# EAGLE schematic sEHnsor (EAGLE 6.5.0)
REVISION: A; TITLE: sEHnsor
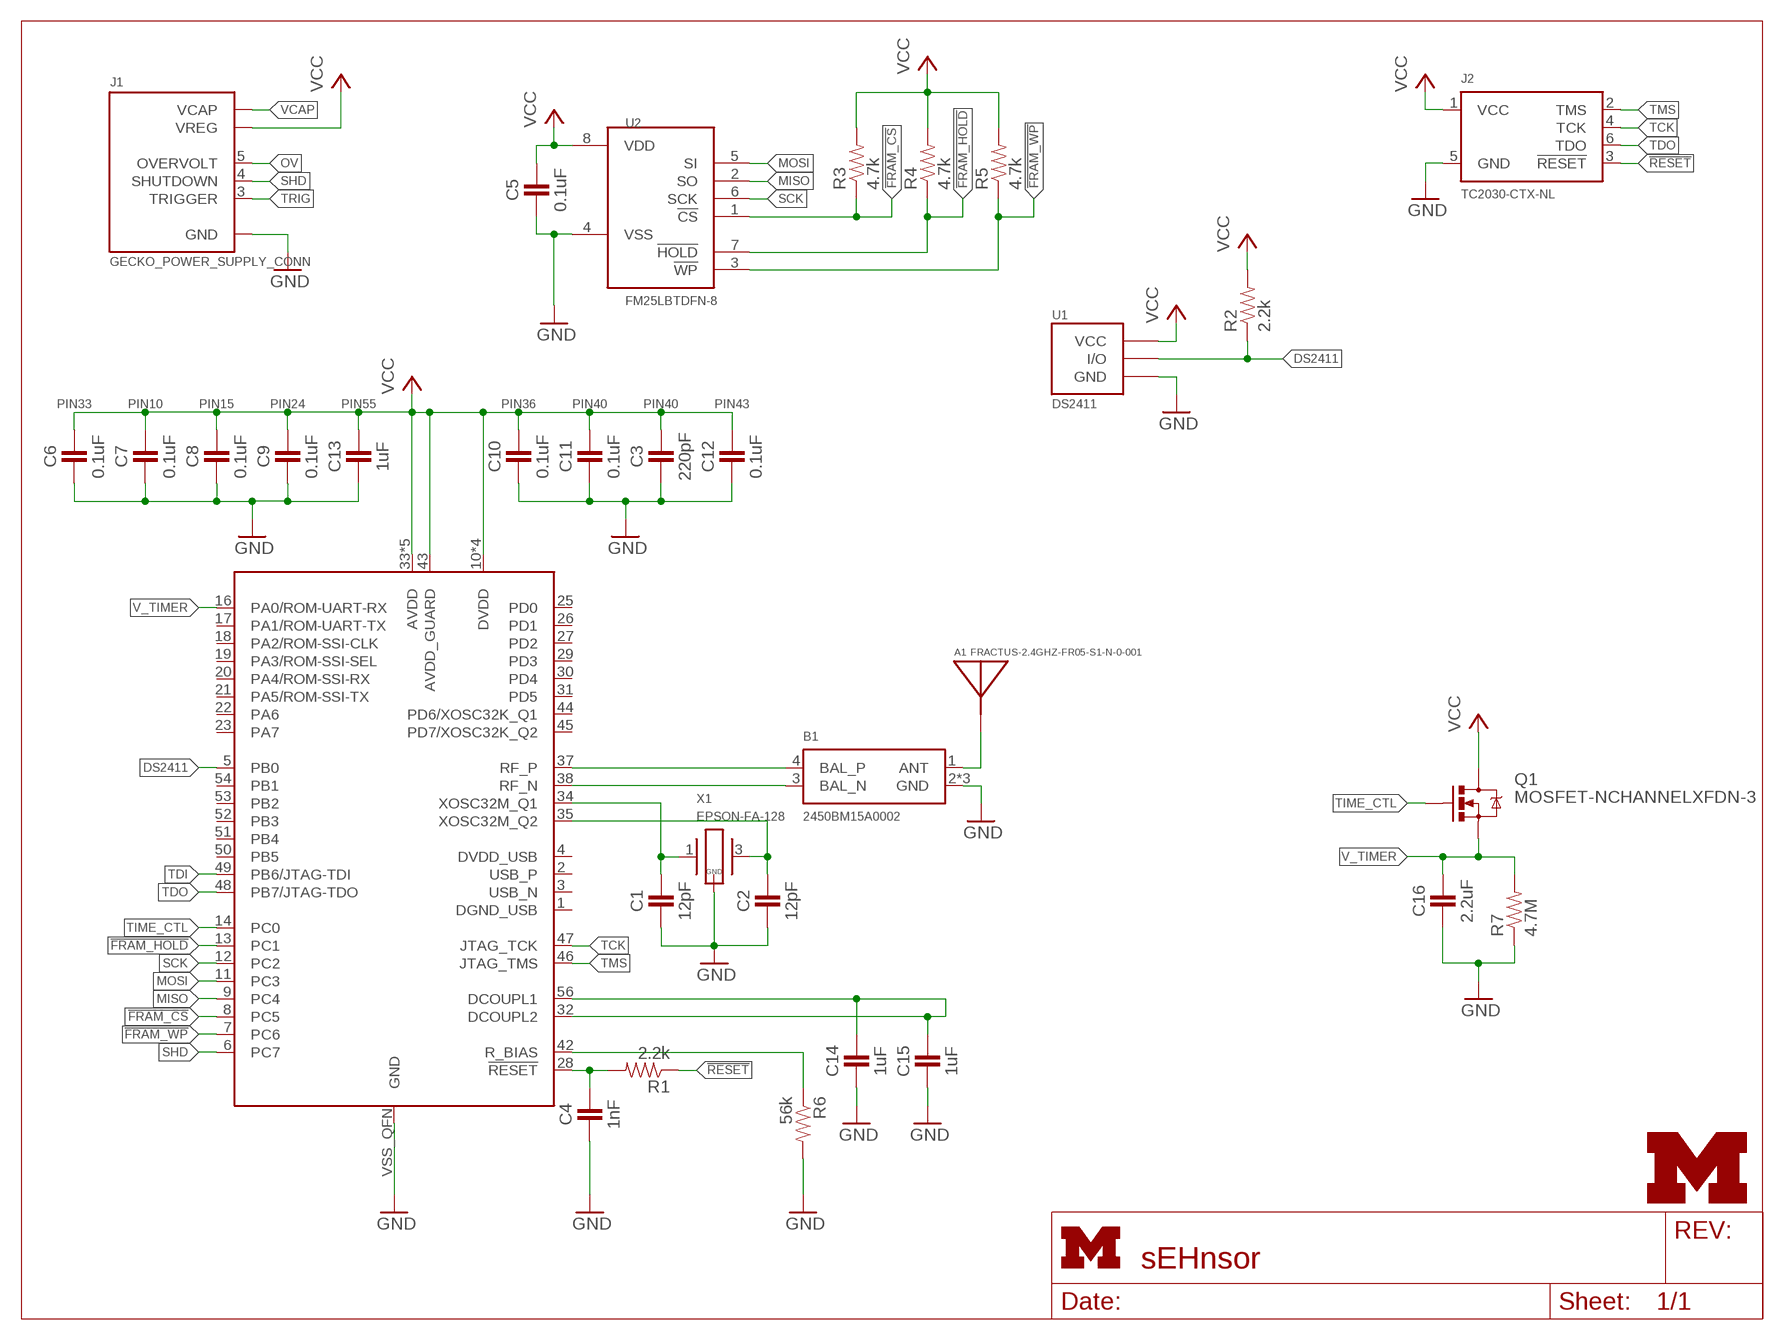
[diagram p0: schematic, sheet 1]
FRAME1 (LETTER_L): HEIGHT: 8.5in; WIDTH: 11in

## Parts
A1  FRACTUS-2.4GHZ-FR05-S1-N-0-001  [FRACTUS-ANTENNA-FR05-S1-N-0-001]
B1  2450BM15A0002  [2450BM]
C1  12pF  CAPACITOR  [0402_CAP]
C2  12pF  CAPACITOR  [0402_CAP]
C3  220pF  CAPACITOR  [0402_CAP]
C4  1nF  CAPACITOR  [0402_CAP]
C5  0.1uF  CAPACITOR  [0402_CAP]
C6  0.1uF  CAPACITOR  [0402_CAP]
C7  0.1uF  CAPACITOR  [0402_CAP]
C8  0.1uF  CAPACITOR  [0402_CAP]
C9  0.1uF  CAPACITOR  [0402_CAP]
C10  0.1uF  CAPACITOR  [0402_CAP]
C11  0.1uF  CAPACITOR  [0402_CAP]
C12  0.1uF  CAPACITOR  [0402_CAP]
C13  1uF  CAPACITOR  [0402_CAP]
C14  1uF  CAPACITOR  [0402_CAP]
C15  1uF  CAPACITOR  [0402_CAP]
C16  2.2uF  CAPACITOR  [0402_CAP]
J1  GECKO_POWER_SUPPLY_CONN  [HEADER1X6/0.05IN]
J2  TC2030-CTX-NL  [TC2030-IDC-NL]
Q1  MOSFET-NCHANNELXFDN-3  [XFDFN-3]
R1  2.2k  RESISTOR  [0402_RES]
R2  2.2k  RESISTOR  [0402_RES]
R3  4.7k  RESISTOR  [0402_RES]
R4  4.7k  RESISTOR  [0402_RES]
R5  4.7k  RESISTOR  [0402_RES]
R6  56k  RESISTOR  [0402_RES]
R7  4.7M  RESISTOR  [0402_RES]
U1  DS2411  [SOT-23]
U2  FM25LBTDFN-8  [TDFN-8]
U3  CC2538  [S-PVQFN-N56]
U$1  UMICH_SOLID_SMALL  [UMICH_SOLID_75MIL]
X1  EPSON-FA-128  [FA-128]

## Nets
!FRAM_CS: R3.1 U2.1(!CS) U3.8(PC5)
!FRAM_HOLD: R4.1 U2.7(!HOLD) U3.13(PC1)
!FRAM_WP: R5.1 U2.3(!WP) U3.7(PC6)
!RESET: J2.3(!RESET) R1.1
ANTENNA: A1.1(ANTENNA) B1.1(ANT)
DS2411: R2.1 U1.1(I/O) U3.5(PB0)
GND: B1.2(GND) B1.5(GND) B1.6(GND) C1.2 C2.2 C3.2 C4.2 C5.2 C6.2 C7.2 C8.2 C9.2 C10.2 C11.2 C12.2 C13.2 C14.2 C15.2 C16.2 J1.1(GND) J2.5(GND) R6.2 R7.1 U1.3(GND) U2.4(VSS) U3.VSS_QFN(GND) X1.2(GND) X1.4(GND)
MISO: U2.2(SO) U3.9(PC4)
MOSI: U2.5(SI) U3.11(PC3)
N$1: C4.1 R1.2 U3.28(!RESET)
N$8: R6.1 U3.42(R_BIAS)
N$9: C1.1 U3.34(XOSC32M_Q1) X1.1
N$10: C2.1 U3.35(XOSC32M_Q2) X1.3
N$15: C14.1 C15.1 U3.32(DCOUPL2) U3.56(DCOUPL1)
OV: J1.5(OVERVOLT)
RF_N: B1.3(BAL_N) U3.38(RF_N)
RF_P: B1.4(BAL_P) U3.37(RF_P)
SCK: U2.6(SCK) U3.12(PC2)
SHD: J1.4(SHUTDOWN) U3.6(PC7)
TCK: J2.4(TCK) U3.47(JTAG_TCK)
TDI: U3.49(PB6/JTAG-TDI)
TDO: J2.6(TDO) U3.48(PB7/JTAG-TDO)
TIME_CTL: Q1.G U3.14(PC0)
TMS: J2.2(TMS) U3.46(JTAG_TMS)
TRIG: J1.3(TRIGGER)
V_TIMER: C16.1 Q1.S R7.2 U3.16(PA0/ROM-UART-RX)
VCAP: J1.6(VCAP)
VCC: C3.1 C5.1 C6.1 C7.1 C8.1 C9.1 C10.1 C11.1 C12.1 C13.1 J1.2(VREG) J2.1(VCC) Q1.D R2.2 R3.2 R4.2 R5.2 U1.2(VCC) U2.8(VDD) U3.10(DVDD) U3.15(DVDD) U3.24(DVDD) U3.33(AVDD) U3.36(AVDD) U3.39(AVDD) U3.40(AVDD) U3.41(AVDD) U3.43(AVDD_GUARD) U3.55(DVDD)
Unconnected: U3.1(DGND_USB) U3.2(USB_P) U3.3(USB_N) U3.4(DVDD_USB) U3.17(PA1/ROM-UART-TX) U3.18(PA2/ROM-SSI-CLK) U3.19(PA3/ROM-SSI-SEL) U3.20(PA4/ROM-SSI-RX) U3.21(PA5/ROM-SSI-TX) U3.22(PA6) U3.23(PA7) U3.25(PD0) U3.26(PD1) U3.27(PD2) U3.29(PD3) U3.30(PD4) U3.31(PD5) U3.44(PD6/XOSC32K_Q1) U3.45(PD7/XOSC32K_Q2) U3.50(PB5) U3.51(PB4) U3.52(PB3) U3.53(PB2) U3.54(PB1)

## Notes on the sheet
- PIN33 | PIN10 | PIN15 | PIN24 | PIN55 | PIN36 | PIN40 | PIN40 | PIN43

## Library data of the parts
A1 = chips:FRACTUS-2.4GHZ-FR05-S1-N-0-001: Fractus Reach Xtend Bluetooth®, Zigbee®, 802.11 b/g/n WLAN Chip Antenna
B1 = chips:2450BM15A0002: BALUN JTI MATCHED ZIGBEE; DIGIKEY: 712-1536-1-ND
C1-C16 = passives:CAPACITOR: 0402 Capacitor
J1 = gecko:GECKO_POWER_SUPPLY_CONN: Header on the gecko power supply board.
J2 = connector:TC2030-CTX: Tag Connect footprint for ARM JTAG. 10 pin ARM Cortex Debug Connector.
Q1 = fets:MOSFET-NCHANNEL: Generic NMOS footprint; DIGIKEY: DMN2400UFB4-7DICT-ND
R1-R7 = passives:RESISTOR: Resistor Basic schematic elements and footprints for 0603, 1206, and PTH resistors.
U1 = chips:DS2411: Maxim DS2411 Silicon Serial Number with VCC Input; DIGIKEY: DS2411R+CT-ND
U2 = chips:FM25LB: IC FRAM 4KBIT 10MHZ 8SOIC; DIGIKEY: FM25L04B-DGRA-ND; MOUSER: 877-FM25L04B-DG
U3 = chips:CC2538: A Powerful System-On-Chip for 2.4-GHz IEEE 802.15.4, 6LoWPAN and ZigBee Applications; DIGIKEY: 296-35797-1-ND; MOUSER: 595-CC2538SF53RTQT; NEWARK: 87W7713
U$1 = logos:UMICH_SOLID
X1 = crystals:EPSON-FA-128: MHz RANGE CRYSTAL UNIT ULTRA MINIATURE SIZE LOW PROFILE SMD http://www.digikey.com/product-search/en?FV=ffec63d1